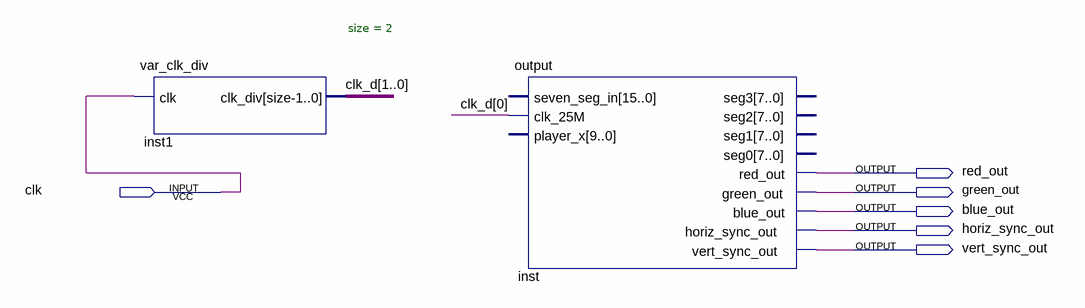
[diagram p0: schematic sheet]
// Quartus schematic test_output.bdf as structural Verilog: 2 symbols, 6 pins
module test_output (
  input  clk,
  output red_out,
  output green_out,
  output blue_out,
  output horiz_sync_out,
  output vert_sync_out
);

  wire [1:0] clk_d;

  var_clk_div #(.size(2)) inst1 (.clk(clk), .clk_div(clk_d));
  \output  inst (
    .clk_25M(clk_d[0]), .red_out(red_out), .green_out(green_out), .blue_out(blue_out),
    .horiz_sync_out(horiz_sync_out), .vert_sync_out(vert_sync_out));  // open: seven_seg_in, player_x, seg3, seg2, seg1, seg0
endmodule
